# Altium schematic sheet Display_Controller.SchDoc
size A; Organization: Altium Limited; Address1: L3, 12a Rodborough Rd; Address2: Frenchs Forest; Address3: NSW; Address4: Australia 2086; DocumentNumber: 3; SheetNumber: 3; SheetTotal: 3
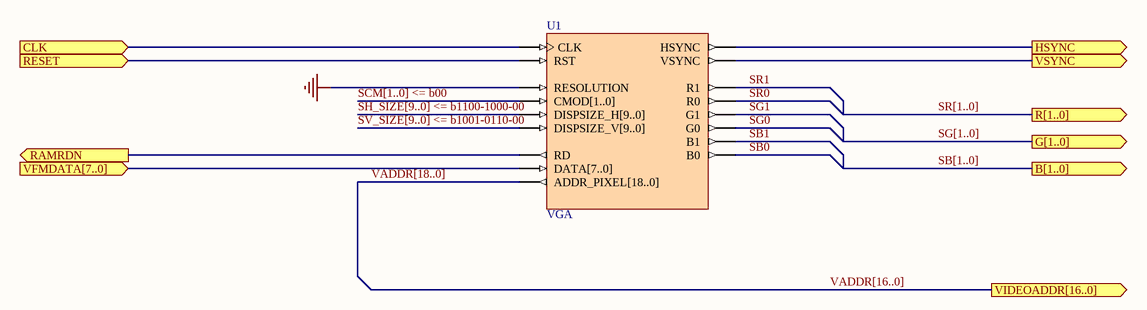
[diagram p0: Display_Controller.SchDoc]

## Parts
U1  VGA

## Ports
B[1..0] (out), CLK (in), G[1..0] (out), HSYNC (out), R[1..0] (out), RAMRDN (out), RESET (in), VFMDATA[7..0] (in), VIDEOADDR[16..0] (out), VSYNC (out)

## Nets
GND: U1.RESOLUTION
CLK: U1.CLK ; port CLK
HSYNC: U1.HSYNC ; port HSYNC
RAMRDN: U1.RD ; port RAMRDN
RESET: U1.RST ; port RESET
SB0: U1.B0
SB1: U1.B1
SCM[1..0] <= b00: U1.CMOD[1..0]
SG0: U1.G0
SG1: U1.G1
SH_SIZE[9..0] <= b1100-1000-00: U1.DISPSIZE_H[9..0]
SR0: U1.R0
SR1: U1.R1
SV_SIZE[9..0] <= b1001-0110-00: U1.DISPSIZE_V[9..0]
VADDR[18..0]: U1.ADDR_PIXEL[18..0]
VFMDATA[7..0]: U1.DATA[7..0] ; port VFMDATA[7..0]
VSYNC: U1.VSYNC ; port VSYNC

## Buses and harness runs
bus SB[1..0] = port B[1..0]
bus SCM[1..0] <= b00
bus SG[1..0] = port G[1..0]
bus SH_SIZE[9..0] <= b1100-1000-00
bus SR[1..0] = port R[1..0]
bus SV_SIZE[9..0] <= b1001-0110-00
bus VADDR[16..0] = port VIDEOADDR[16..0]
bus VADDR[18..0]

## Notes on the sheet
- Title
- Size:
- Date:
- A
- Number:
- Time:
- Revision:
- Sheet
- of
- File:

## Library data of the parts
U1 = VGA: VGA Controller; Published: 20/10/2003; Publisher: Altium Hobart Technology Centre; Core Revision: 1.00.00